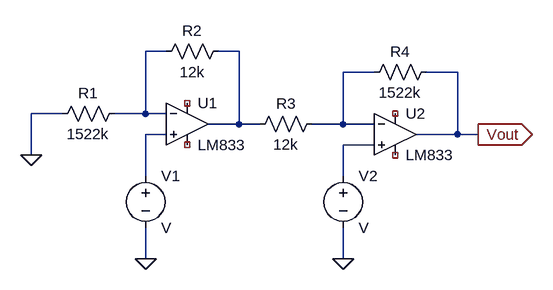
[diagram p0: schematic IA.asc]
IA.asc, the LTspice schematic file:
Version 4
SHEET 1 880 680
WIRE 160 96 128 96
WIRE 272 96 240 96
WIRE 480 128 432 128
WIRE 608 128 560 128
WIRE 0 192 -48 192
WIRE 128 192 128 96
WIRE 128 192 80 192
WIRE 160 192 128 192
WIRE 272 208 272 96
WIRE 272 208 224 208
WIRE 304 208 272 208
WIRE 432 208 432 128
WIRE 432 208 384 208
WIRE 480 208 432 208
WIRE 160 224 128 224
WIRE 608 224 608 128
WIRE 608 224 544 224
WIRE 640 224 608 224
WIRE 480 240 432 240
WIRE -48 256 -48 192
WIRE 128 288 128 224
WIRE 432 288 432 240
WIRE 128 416 128 368
WIRE 432 416 432 368
FLAG -48 256 0
FLAG 128 416 0
FLAG 432 416 0
FLAG 640 224 Vout
IOPIN 640 224 Out
SYMBOL res 96 176 R90
WINDOW 0 0 56 VBottom 2
WINDOW 3 32 56 VTop 2
SYMATTR InstName R1
SYMATTR Value 1522k
SYMBOL res 256 80 R90
WINDOW 0 0 56 VBottom 2
WINDOW 3 32 56 VTop 2
SYMATTR InstName R2
SYMATTR Value 12k
SYMBOL res 400 192 R90
WINDOW 0 0 56 VBottom 2
WINDOW 3 32 56 VTop 2
SYMATTR InstName R3
SYMATTR Value 12k
SYMBOL res 576 112 R90
WINDOW 0 0 56 VBottom 2
WINDOW 3 32 56 VTop 2
SYMATTR InstName R4
SYMATTR Value 1522k
SYMBOL voltage 128 272 R0
SYMATTR InstName V1
SYMBOL voltage 432 272 R0
SYMATTR InstName V2
SYMBOL Opamps\\opamp2 192 144 R0
SYMATTR InstName U1
SYMATTR Value LM833
SYMBOL Opamps\\opamp2 512 160 R0
SYMATTR InstName U2
SYMATTR Value LM833

The netlist it stands for:
* IA.asc
R1 N001 0 1522k
R2 N002 N001 12k
R3 N003 N002 12k
R4 Vout N003 1522k
V1 N004 0 V
V2 N005 0 V
XU1 N004 N001 NC_01 NC_02 N002 LM833  ; pins In+ In- V+ V- OUT
XU2 N005 N003 NC_03 NC_04 Vout LM833  ; pins In+ In- V+ V- OUT
.backanno
.end